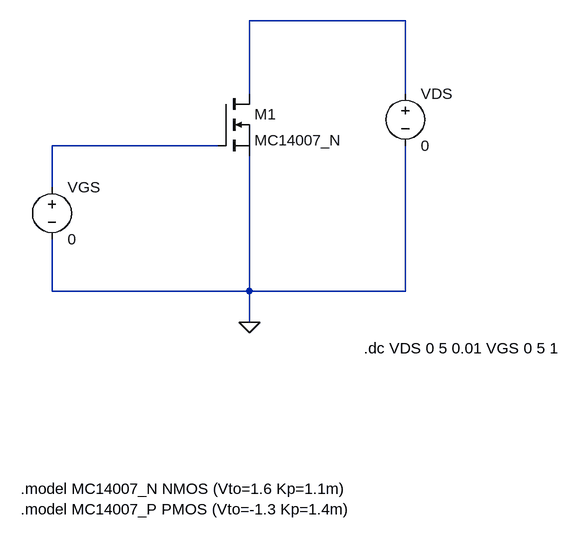
[diagram p0: schematic 11.asc]
11.asc, the LTspice schematic file:
Version 4.1
SHEET 1 880 680
WIRE 608 -112 368 -112
WIRE 368 0 368 -112
WIRE 608 0 608 -112
WIRE 320 80 64 80
WIRE 64 144 64 80
WIRE 64 304 64 224
WIRE 368 304 368 96
WIRE 368 304 64 304
WIRE 608 304 608 80
WIRE 608 304 368 304
WIRE 368 352 368 304
FLAG 368 352 0
SYMBOL voltage 64 128 R0
SYMATTR InstName VGS
SYMATTR Value 0
SYMBOL voltage 608 -16 R0
SYMATTR InstName VDS
SYMATTR Value 0
SYMBOL nmos 320 0 R0
SYMATTR InstName M1
SYMATTR Value MC14007_N
TEXT 16 608 Left 2 !.model MC14007_N NMOS (Vto=1.6 Kp=1.1m)\n.model MC14007_P PMOS (Vto=-1.3 Kp=1.4m)
TEXT 544 392 Left 2 !.dc VDS 0 5 0.01 VGS 0 5 1

The netlist it stands for:
* 11.asc
VGS N002 0 0
VDS N001 0 0
M1 N001 N002 0 0 MC14007_N
.model NMOS NMOS
.model PMOS PMOS
.lib standard.mos
.model MC14007_N NMOS (Vto=1.6 Kp=1.1m)
.model MC14007_P PMOS (Vto=-1.3 Kp=1.4m)
.dc VDS 0 5 0.01 VGS 0 5 1
.backanno
.end